# Altium schematic sheet 06. ETHERNET.SchDoc
size A3
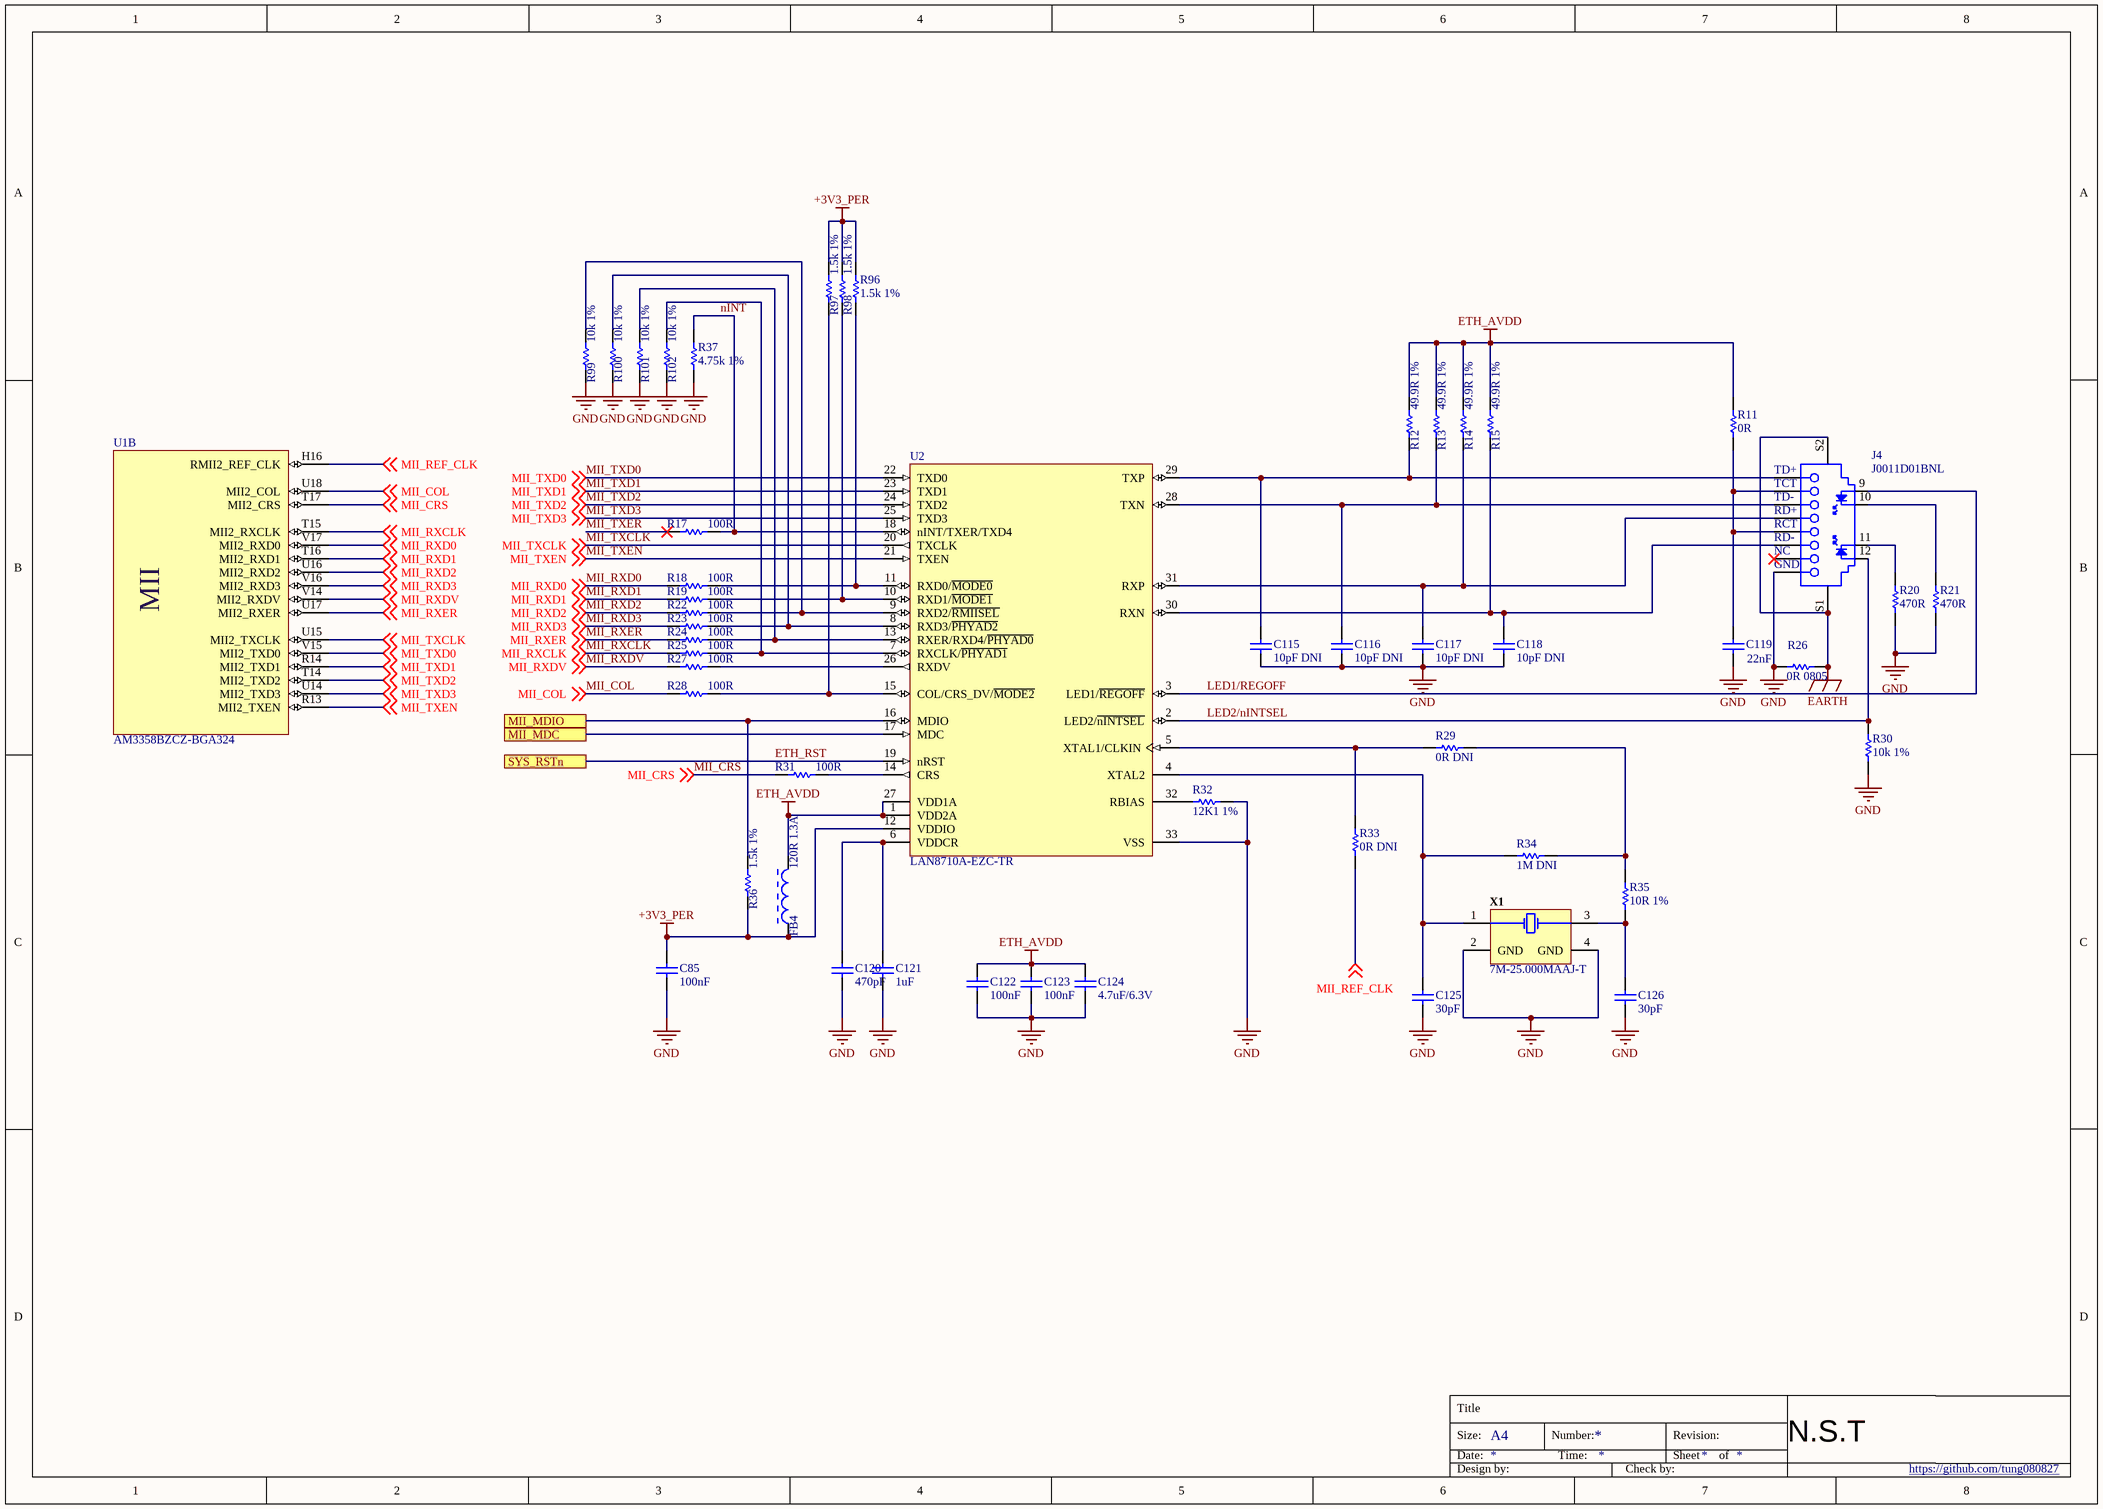
[diagram p0: 06. ETHERNET.SchDoc]

## Parts
C85  100nF  [CAPC1005X60X30LL05T10]
C115  10pF DNI  [CAPC1005X60X30LL05T10]
C116  10pF DNI  [CAPC1005X60X30LL05T10]
C117  10pF DNI  [CAPC1005X60X30LL05T10]
C118  10pF DNI  [CAPC1005X60X30LL05T10]
C119  22nF  [CAPC1005X60X30LL05T10]
C120  470pF  [CAPC1005X60X30LL05T10]
C121  1uF  [CAPC1005X55X25NL05T10]
C122  100nF  [CAPC1005X60X30LL05T10]
C123  100nF  [CAPC1005X60X30LL05T10]
C124  4.7uF/6.3V  [CAPC1005X55X25NL05T10]
C125  30pF  [CAPC1005X60X30LL05T10]
C126  30pF  [CAPC1005X60X30LL05T10]
FB4  120R 1.3A  [MURA-BLM15-CHIP-2_V]
J4  J0011D01BNL  [J0011D01BNL 1PORT 100 BASE-TX]
R11  0R  [RESC1005X40X25LL05T05]
R12  49.9R 1%  [RESC1005X40X25LL05T05]
R13  49.9R 1%  [RESC1005X40X25LL05T05]
R14  49.9R 1%  [RESC1005X40X25LL05T05]
R15  49.9R 1%  [RESC1005X40X25LL05T05]
R17  100R  [RESC1005X40X25LL05T05]
R18  100R  [RESC1005X40X25LL05T05]
R19  100R  [RESC1005X40X25LL05T05]
R20  470R  [RESC1005X40X25LL05T05]
R21  470R  [RESC1005X40X25LL05T05]
R22  100R  [RESC1005X40X25LL05T05]
R23  100R  [RESC1005X40X25LL05T05]
R24  100R  [RESC1005X40X25LL05T05]
R25  100R  [RESC1005X40X25LL05T05]
R26  0R 0805  [RESC2013X50X30LL20T20]
R27  100R  [RESC1005X40X25LL05T05]
R28  100R  [RESC1005X40X25LL05T05]
R29  0R DNI  [RESC1005X40X25LL05T05]
R30  10k 1%  [RESC1005X40X25LL05T05]
R31  100R  [RESC1005X40X25LL05T05]
R32  12K1 1%  [RESC1005X40X25LL05T05]
R33  0R DNI  [RESC1005X40X25LL05T05]
R34  1M DNI  [RESC1005X40X25LL05T05]
R35  10R 1%  [RESC1005X40X25LL05T05]
R36  1.5k 1%  [RESC1005X40X25LL05T05]
R37  4.75k 1%  [RESC1005X40X25LL05T05]
R96  1.5k 1%  [RESC1005X40X25LL05T05]
R97  1.5k 1%  [RESC1005X40X25LL05T05]
R98  1.5k 1%  [RESC1005X40X25LL05T05]
R99  10k 1%  [RESC1005X40X25LL05T05]
R100  10k 1%  [RESC1005X40X25LL05T05]
R101  10k 1%  [RESC1005X40X25LL05T05]
R102  10k 1%  [RESC1005X40X25LL05T05]
U1  AM3358BZCZ-BGA324  [TI-ZCZ324]  (part B of 11)
U2  LAN8710A-EZC-TR  [MCHP-QFN-32-5x5_V1]
X1  7M-25.000MAAJ-T  [FP-NX3225SA-MFG]

## Ports
MII_MDC, MII_MDIO, SYS_RSTn

## Nets
+3V3_PER: C85.2 FB4.1 R36.1 R96.1 R97.2 R98.2 U2.12(VDDIO)
EARTH: J4.S1 J4.S2 R26.2
ETH_AVDD: C122.2 C123.2 C124.2 FB4.2 R11.2 R12.2 R13.2 R14.2 R15.2 U2.1(VDD2A) U2.27(VDD1A)
GND: C85.1 C115.1 C116.1 C117.1 C118.1 C119.1 C120.1 C121.1 C122.1 C123.1 C124.1 C125.1 C126.1 J4.8(GND) R20.1 R21.1 R26.1 R30.1 R32.2 R37.1 R99.1 R100.1 R101.1 R102.1 U2.33(VSS) X1.2(GND) X1.4(GND)
ETH_RST: U2.19(nRST) ; port SYS_RSTn
LED1/REGOFF: J4.9 U2.3(LED1/~{REGOFF})
LED2/nINTSEL: J4.12 R30.2 U2.2(LED2/~{nINTSEL})
MII_COL: R28.1 U1.U18(MII2_COL) ; off-sheet MII_COL
MII_CRS: R31.1 U1.T17(MII2_CRS) ; off-sheet MII_CRS
MII_MDC: U2.17(MDC) ; port MII_MDC
MII_MDIO: R36.2 U2.16(MDIO) ; port MII_MDIO
MII_REF_CLK: R33.1 U1.H16(RMII2_REF_CLK) ; off-sheet MII_REF_CLK
MII_RXCLK: R25.1 U1.T15(MII2_RXCLK) ; off-sheet MII_RXCLK
MII_RXD0: R18.1 U1.V17(MII2_RXD0) ; off-sheet MII_RXD0
MII_RXD1: R19.1 U1.T16(MII2_RXD1) ; off-sheet MII_RXD1
MII_RXD2: R22.1 U1.U16(MII2_RXD2) ; off-sheet MII_RXD2
MII_RXD3: R23.1 U1.V16(MII2_RXD3) ; off-sheet MII_RXD3
MII_RXDV: R27.1 U1.V14(MII2_RXDV) ; off-sheet MII_RXDV
MII_RXER: R24.1 U1.U17(MII2_RXER) ; off-sheet MII_RXER
MII_TXCLK: U1.U15(MII2_TXCLK) U2.20(TXCLK) ; off-sheet MII_TXCLK
MII_TXD0: U1.V15(MII2_TXD0) U2.22(TXD0) ; off-sheet MII_TXD0
MII_TXD1: U1.R14(MII2_TXD1) U2.23(TXD1) ; off-sheet MII_TXD1
MII_TXD2: U1.T14(MII2_TXD2) U2.24(TXD2) ; off-sheet MII_TXD2
MII_TXD3: U1.U14(MII2_TXD3) U2.25(TXD3) ; off-sheet MII_TXD3
MII_TXEN: U1.R13(MII2_TXEN) U2.21(TXEN) ; off-sheet MII_TXEN
MII_TXER: R17.1
nINT: R17.2 R37.2 U2.18(nINT/TXER/TXD4)
NetC115_2: C115.2 J4.1(TD+) R12.1 U2.29(TXP)
NetC116_2: C116.2 J4.3(TD-) R13.1 U2.28(TXN)
NetC117_2: C117.2 J4.4(RD+) R14.1 U2.31(RXP)
NetC118_2: C118.2 J4.6(RD-) R15.1 U2.30(RXN)
NetC119_2: C119.2 J4.2(TCT) J4.5(RCT) R11.1
NetC120_2: C120.2 C121.2 U2.6(VDDCR)
NetC125_2: C125.2 R34.1 U2.4(XTAL2) X1.1(X1)
NetC126_2: C126.2 R35.1 X1.3(X2)
NetJ4_10: J4.10 R21.2
NetJ4_11: J4.11 R20.2
NetR18_2: R18.2 R96.2 U2.11(RXD0/~{MODE0})
NetR19_2: R19.2 R98.1 U2.10(RXD1/~{MODE1})
NetR22_2: R22.2 R99.2 U2.9(RXD2/~{RMIISEL})
NetR23_2: R23.2 R100.2 U2.8(RXD3/~{PHYAD2})
NetR24_2: R24.2 R101.2 U2.13(RXER/RXD4/~{PHYAD0})
NetR25_2: R25.2 R102.2 U2.7(RXCLK/~{PHYAD1})
NetR27_2: R27.2 U2.26(RXDV)
NetR28_2: R28.2 R97.1 U2.15(COL/CRS_DV/~{MODE2})
NetR29_1: R29.1 R33.2 U2.5(XTAL1/CLKIN)
NetR29_2: R29.2 R34.2 R35.2
NetR31_2: R31.2 U2.14(CRS)
NetR32_1: R32.1 U2.32(RBIAS)

Not connected (* = marked no-connect by the designer): J4 7(NC)*

## Notes on the sheet
- Title
- Size:
- Date:
- A4
- Number:
- Time:
- Revision:
- Sheet
- of
- N.S.T
- Design by:
- Check by:
- https://github.com/tung080827
- (in symbol AM3358BZCZ100, part B) MII

## Library data of the parts
C85 C122 C123 = CMP-2100-03641-1: Chip Capacitor, 0.1 uF, +/- 10%, 16 V, -55 to 125 degC, 0402 (1005 Metric), RoHS, Tape and Reel; Manufacturer: Murata; Material: Ceramic; Insulation Resistance: 10GR; Voltage: 16V; Dielectric: X7R; REACH SVHC: NoSVHC; Depth: 0.5mm; Case/Package: 0402; Datasheet URL: http://psearch.en.murata.com/capacitor/product/GRM155R71C104KA88%23.pdf; Lead Free: LeadFree; Dielectric Material: Ceramic; Manufacturer URL: http://www.murata.com/; Min Operating Temperature: -55degC; Length: 1mm; Case Code (Metric): 1005; Radiation Hardening: No; Package Reference: 0402; RoHSCompliant: true; Datasheet Version: 42675.0; Thickness: 0.022inch; Packaging: TapeandReel; Voltage Rating (DC): 16V; Tolerance: 10%; Max Operating Temperature: 125degC; Package Description: 2-Pin Surface Mount Device, Body 1 x 0.5 mm; Mount: SurfaceMount; Height: 0.5mm; Width: 0.5mm; Number of Pins: 2; Voltage Rating: 16V; Case Code (Imperial): 0402; Termination: SMD/SMT; Capacitance: 100nF; Package Quantity: 1
C115-C118 = CMP-2008-03971-1: Manufacturer: Murata; Part Number: GRM1555C1E100JA01D
C119 = CMP-2008-04654-1: Part Number: GRM155R71H223KA12D; Manufacturer: Murata
C120 = CMP-1034-01502-1: CAP 470pF 50V ±10% 0402 (1005 Metric) Thickness 0.6mm SMD; Case-Metric: 1005; Tolerance: Â±10%; Case-EIA: 0402; Technology: SMT; Value: 470pF; Max Thickness: 0.6 mm; Rated Voltage: 50 V
C121 = CMP-2008-04556-1: Part Number: GRM155R61A105KE15D; Manufacturer: Murata
C124 = CMP-2008-04549-1: Part Number: GRM155R60J475ME47D; Manufacturer: Murata
C125 C126 = CMP-2008-04333-1: Part Number: GRM1555C1H300JA01D; Manufacturer: Murata
FB4 = CMP-0686-00281-3: Chip Ferrite Bead for Power Lines, 120 Ohm, 1300 mA, -55 to 125 degC, 1 x 0.5 x 0.55 mm SMD, Tape and Reel; PartNumber: BLM15PD121SN1D; Manufacturer: Murata; DC Resistance: 0.09 Ohm Max.; Rated Current: 1300 mA; Impedance (at 100 MHz): 120 Ohm +/- 25%; ComponentLink1URL: http://www.murata.com/; DatasheetVersion: 08/2013; Operating Temperature Range: -55 to 125 degC; ComponentLink2Description: Datasheet; Mounting Technology: Surface Mount; PackageReference: BLM15-2; ComponentLink2URL: http://www.murata.com/products/catalog/pdf/c31e.pdf; ComponentLink3URL: http://www.murata.com/products/catalog/pdf/c31e.pdf; ComponentLink3Description: Package Specification; ComponentLink1Description: Manufacturer URL; Packing: Tape and Reel; PackageDescription: 2-Pin Chip, Body 1 x 0.5 mm
J4 = CMP-2000-06492-1: RJ45 Connector, Pitch 1.27 mm, 12 Position, Height 13.84 mm, Tail Length 3.3 mm, 0 to 70 degC, RoHS, Tray; Manufacturer: Pulse Electronics; Dynamic Catalog: PULSEJACK™J0andJ2Series; Shield Material: Brass; Shielding: Shielded; LED Color: Green-Yellow; Number of Ports: 1; Number of Cores per Jack: 4; Catalog Drawings: PULSEJACKRightAngle1x1; Other Names: 553-1483 / J0011D01BNL-ND; Tab Direction: Down; Package Description: RJ45 Connector, Pitch 1.27 mm, 12 Position, Height 13.84 mm, Tail Length 3.3 mm; Number of Rows: 1; Contact Finish Thickness: 15µin(0.38µm); Datasheet URL: http://productfinder.pulseeng.com/products/datasheets/J403.pdf; Connector Type: RJ45; Mounting Type: ThroughHole; Package Reference: J0-A; Orientation: 90°Angle(Right); Termination: Solder; Datasheet Version: Rev. K, 08/2012; Applications: 10/100Base-TX,AutoMDIX; Series: PULSEJACK™J0; Contact Finish: Gold; Height Above Board: 0.545"(13.84mm); Operating Temperature: 0°C~70°C; Packaging: Tray; Contact Material: PhosphorBronze; Standard Package: 30; Housing Material: Thermoplastic; Features: BoardGuide; Category: Connectors,Interconnects; Mounting Technology: ThroughHole; Manufacturer URL: http://www.pulseelectronics.com/; Family: ModularConnectors-JacksWithMagnetics
R11 R35 = CMP-2002-03046-1: Part Number: CRCW040210R0FKEDHP; Manufacturer: Vishay Dale
R12-R15 = CMP-2002-00969-1: Precision Thick Film Chip Resistors; Manufacturer: Panasonic; Part Number: ERJ-2RKF49R9X
R17-R19 R22-R25 R27 R28 R31 = CMP-2002-00431-1: Manufacturer: Panasonic; Part Number: ERJ-2GEJ101X
R20 R21 = CMP-2000-03373-1: Part Number: CRCW0603470RFKEA; Manufacturer: Vishay Dale
R26 = CMP-2001-04896-1: Manufacturer: Vishay Dale; Part Number: CRCW08050000Z0EA
R29 R33 = CMP-2002-07912-1: Manufacturer: Yageo / Phycomp; Part Number: RC0402JR-070RL
R30 = CMP-2002-08135-1: Manufacturer: Vishay Dale; Part Number: CRCW040210K0FKED
R32 = CMP-1011-00632-1: 12K1 0.063W 1% 0402 (1005 Metric)  SMD; Case-EIA: 0402; Value: 12100.00 Ohm; Case-Metric: 1005; Power: 0.063 W; Tolerance: 1 %; Technology: SMT
R34 = CMP-2002-00609-3: Chip Resistor, 1 MOhm, +/- 1%, 100 mW, -55 to 155 degC, 0402 (1005 Metric), RoHS, Tape and Reel; PartNumber: ERJ-2RKF1004X; Manufacturer: Basic Passives; Voltage Rating: 50 V; Case\/Package: 0402; Resistance: 1 MOhm; Power Rating: 100 mW; Pins: 2; Max Operating Temperature: 155 degC; ComponentLink2URL: http://industrial.panasonic.com/cdbs/www-data/pdf/RDA0000/AOA0000C86.pdf; Weight: 2.8E-05oz; ComponentLink1URL: http://www.panasonic.com/; Radiation Hardening: No; Height: 0.35 mm; Case Code (Imperial): 0402; ComponentLink2Description: Datasheet; Mount: Surface Mount; ComponentLink1Description: Manufacturer URL; REACH SVHC: Yes; Length: 1 mm; Min Operating Temperature: -55 degC; Width: 0.5 mm; Package Quantity: 10000; Tolerance: 1%; PackageDescription: 2-Pin Surface Mount Device, Body 1 x 0.5 mm; RoHSCompliant: true; DatasheetVersion: 04/2015; PackageReference: 0402; Mounting Technology: Surface Mount; Case Code (Metric): 1005; Packaging: Tape and Reel
R36 R96-R98 = CMP-2002-02933-1: Manufacturer: Yageo; Part Number: RT0402BRD071K5L
R37 = CMP-2002-00054-1: Manufacturer: Vishay Dale; Part Number: CRCW04024K75FKED
R99-R102 = CMP-2002-08135-1: 10k 0.063W 1% 0402 (1005 Metric)  SMD; Manufacturer: Vishay Dale; Part Number: CRCW040210K0FKED
U1 = AM3358BZCZ100: Sitara ARM Cortex-A8 32-Bit RISC Microprocessor, 1 GHz, SGX530 3D Graphics Engine, Programmable Real-Time Unit and Industrial Communication Subsystem (PRU-ICSS), 0 to 90 degC, 324-pin NFBGA (ZCZ), Green (RoHS & no Sb/Br); Supplier 1: Digi-Key
U2 = CMP-0186-00334-1: Small Footprint, Low Power Consumption, Full-Featured MII/RMII 10/100 Ethernet Transceiver with HP, 1.6 to 3.6 V, 0 to 85 degC, 32-Pin QFN, RoHS, Tape and Reel; Manufacturer: Microchip; Downstream Ports: Ethernet x1; LEDs: 4; Op. Voltage (V): 3.3; ComponentLink3Description: Package Specification; PartNumber: LAN8710A-EZC-TR; Interface (UpStream): MII/RMII; DatasheetVersion: Rev. 1.4; Mounting Technology: Surface Mount; ComponentLink3URL: http://ww1.microchip.com/downloads/en/DeviceDoc/8710a.pdf; Packing: Tape and Reel; Temperature Range (degC): 0 to 85; ComponentLink2URL: http://ww1.microchip.com/downloads/en/DeviceDoc/8710a.pdf; ComponentLink1Description: Manufacturer URL; PackageVersion: Rev. 1.4; RoHS: TRUE; PackageReference: QFN-32; ComponentLink1URL: http://www.microchip.com/; PackageDescription: 32-Pin Quad Flat No-lead Package, Body 5 x 5 mm, Pitch 0.5 mm; Flexible I/O Voltage (V): 1.6 to 3.6; ComponentLink2Description: Datasheet
X1 = CMP-2000-05694-1: SMD Seam Sealing Crystal, 25 MHz, +/- 30 ppm, 18 pF, -20 to 70 degC, 4-Pin SMD, RoHS, Tape and Reel; Manufacturer: TXC; Other Names: 7M25000MAAJT / 887-1132-2; Frequency Tolerance: ±30ppm; Catalog Drawings: 7MSeriesTop7MSeriesBottom7MSeriesSide7MSeriesCircuit; Online Catalog: 7MSeries; Operating Mode: Fundamental; ESR (Equivalent Series Resistance): 60Ohm; EDA / CAD Models: DownloadfromAcceleratedDesigns; Frequency: 25MHz; Load Capacitance: 18pF; Operating Temperature: -20°C~70°C; Size / Dimension: 0.126"Lx0.098"W(3.20mmx2.50mm); Frequency Stability: ±30ppm; Datasheet URL: http://www.txccrystal.com/images/pdf/7m.pdf; Category: CrystalsandOscillators; Series: 7M; Package Description: 4-Pin Surface Mount Device, Body 3.2 x 2.5 mm; Packaging: Tape&Reel(TR); Mounting Technology: SurfaceMount; Standard Package: 3,000; Family: Crystals; Package / Case: 4-SMD,NoLead(DFN,LCC); Height: 0.031"(0.80mm); Type: MHzCrystal; Manufacturer URL: http://www.txccorp.com/; Datasheet Version: 01/2014; Mounting Type: SurfaceMount; Package Reference: 7M-4